# Altium schematic sheet PMOD_STMod+ connector .SchDoc: PMOD STMod+ Connector
size A4; Project: STM32H7-DK; Date: Not used; ApprovedBy: Not used; CheckedBy: Not used; Author: Not used; CompanyName: STMicroelectronics; DrawnBy: Not used; Engineer: Not used; Organization: Not used; Address1: Not used; Address2: Not used; Address3: Not used; Address4: Not used; DocumentNumber: Not used; Revision: Not used; SheetNumber: 11; SheetTotal: 16; CurrentTime: Not used; CurrentDate: Not used; Time: Not used; DocumentFullPathAndName: Not used; DocumentName: Not used; ModifiedDate: Not used; ImagePath: Not used; ProjectName: Not used; Application_BuildNumber: Not used
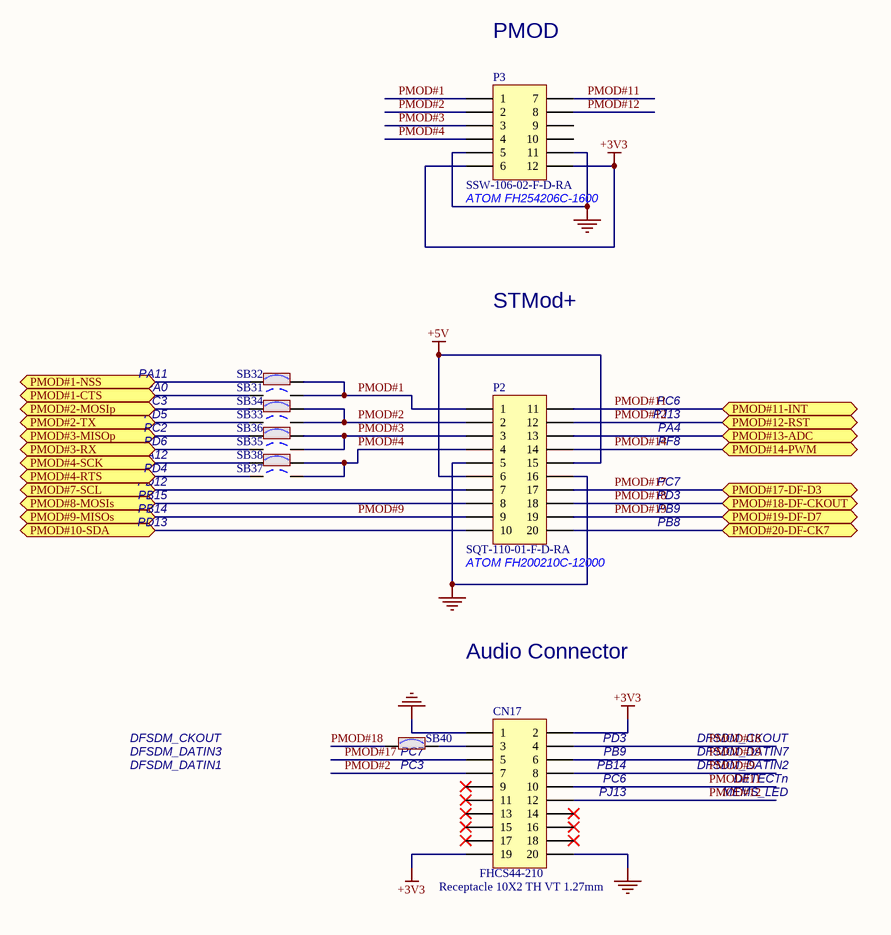
[diagram p0: PMOD_STMod+ connector .SchDoc]

## Parts
CN17  Receptacle 10X2 TH VT 1.27mm  Order_Code: FHCS44-210  [MODULE_20TH_48X29]
P2  SQT-110-01-F-D-RA  [SQT-110-01-F-D-RA]
P3  SSW-106-02-F-D-RA  [SSW-106-02-F-D-RA]
SB31  Solder Bridge OFF  [SB_0603]  (value not drawn)
SB32  Solder Bridge ON  [SB_0603]  (value not drawn)
SB33  Solder Bridge OFF  [SB_0603]  (value not drawn)
SB34  Solder Bridge ON  [SB_0603]  (value not drawn)
SB35  Solder Bridge OFF  [SB_0603]  (value not drawn)
SB36  Solder Bridge ON  [SB_0603]  (value not drawn)
SB37  Solder Bridge OFF  [SB_0603]  (value not drawn)
SB38  Solder Bridge ON  [SB_0603]  (value not drawn)
SB40  Solder Bridge ON  [SB_0603]  (value not drawn)

## Ports
PMOD#1-CTS (bidir), PMOD#1-NSS (bidir), PMOD#2-MOSIp (bidir), PMOD#2-TX (bidir), PMOD#3-MISOp (bidir), PMOD#3-RX (bidir), PMOD#4-RTS (bidir), PMOD#4-SCK (bidir), PMOD#7-SCL (bidir), PMOD#8-MOSIs (bidir), PMOD#9-MISOs (bidir), PMOD#10-SDA (bidir), PMOD#11-INT (bidir), PMOD#12-RST (bidir), PMOD#13-ADC (bidir), PMOD#14-PWM (bidir), PMOD#17-DF-D3 (bidir), PMOD#18-DF-CKOUT (bidir), PMOD#19-DF-D7 (bidir), PMOD#20-DF-CK7 (bidir)

## Nets
+3V3: CN17.2 CN17.19 P3.6 P3.12
+5V: P2.6 P2.15
GND: CN17.1 CN17.20 P2.5 P2.16 P3.5 P3.11
PMOD#1: P2.1 P3.1 SB31.2 SB32.2
PMOD#1-CTS: SB31.1 ; port PMOD#1-CTS
PMOD#1-NSS: SB32.1 ; port PMOD#1-NSS
PMOD#2: CN17.7 P2.2 P3.2 SB33.2 SB34.2
PMOD#2-MOSIp: SB34.1 ; port PMOD#2-MOSIp
PMOD#2-TX: SB33.1 ; port PMOD#2-TX
PMOD#3: P2.3 P3.3 SB35.2 SB36.2
PMOD#3-MISOp: SB36.1 ; port PMOD#3-MISOp
PMOD#3-RX: SB35.1 ; port PMOD#3-RX
PMOD#4: P2.4 P3.4 SB37.2 SB38.2
PMOD#4-RTS: SB37.1 ; port PMOD#4-RTS
PMOD#4-SCK: SB38.1 ; port PMOD#4-SCK
PMOD#7-SCL: P2.7 ; port PMOD#7-SCL
PMOD#8-MOSIs: P2.8 ; port PMOD#8-MOSIs
PMOD#9: CN17.8 P2.9 ; port PMOD#9-MISOs
PMOD#10-SDA: P2.10 ; port PMOD#10-SDA
PMOD#11: CN17.10 P2.11 P3.7 ; port PMOD#11-INT
PMOD#12: CN17.12 P2.12 P3.8 ; port PMOD#12-RST
PMOD#13-ADC: P2.13 ; port PMOD#13-ADC
PMOD#14: P2.14 ; port PMOD#14-PWM
PMOD#17: CN17.5 P2.17 ; port PMOD#17-DF-D3
PMOD#18: CN17.4 P2.18 SB40.1 ; port PMOD#18-DF-CKOUT
PMOD#19: CN17.6 P2.19 ; port PMOD#19-DF-D7
PMOD#20-DF-CK7: P2.20 ; port PMOD#20-DF-CK7
NetCN17_3: CN17.3 SB40.2

Not connected (* = marked no-connect by the designer): CN17 9* 11* 13* 14* 15* 16* 17* 18*; P3 9 10

## Notes on the sheet
- PMOD
- (near P3) ATOM FH254206C-1600
- STMod+
- PA0
- PD5
- PC3
- PA11
- PJ13
- PC6
- PD6
- PC2
- PA12
- PD12
- PD4
- PA4
- PF8
- PC7
- PB15
- PB14
- PD13
- PD3
- PB9
- PB8
- (near P2) ATOM FH200210C-12000
- Audio Connector
- DFSDM_CKOUT
- DFSDM_DATIN3
- (near SB40) PC7
- DFSDM_DATIN7
- DFSDM_DATIN1
- (near SB40) PC3
- DFSDM_DATIN2
- DETECTn
- MEMS_LED
- Title:
- Project:
- Size:
- Revision:
- Variant:
- A4
- -
- Date:
- Reference:
- Sheet:
- of

## Library data of the parts
CN17 = Receptacle 10X2 TH VT 1.27mm: 20 Position Receptacle Connector 0.050" (1.27mm) Through Hole Vertical Mount; Manuf_1: WINPIN; Fitted: YES; Ordered_By: Subcon; Manuf_Part_1: FHCS44-210; Value: Receptacle 10X2 TH VT 1.27mm; Distrib: *; ECCN_US/EU: n/a
P2 = Header 10X2A: Header, 10-Pin, Dual row; LatestRevisionDate: 17-Jul-2002; LatestRevisionNote: Re-released for DXP Platform.; Publisher: Altium Limited
P3 = Header 6X2A: Header, 6-Pin, Dual row; LatestRevisionDate: 17-Jul-2002; LatestRevisionNote: Re-released for DXP Platform.; Publisher: Altium Limited
SB31 SB33 SB35 SB37 = SB_OFF: Fitted: NO; Ordered by: Subcon; Revision: July-2002: Re-released for DXP Platform.; ECCN_US/EU: n/a
SB32 SB34 SB36 SB38 SB40 = SB_ON: Fitted: YES; Ordered by: Subcon; Revision: July-2002: Re-released for DXP Platform.; ECCN_US/EU: n/a